# Altium project imu-extend.PrjPcb
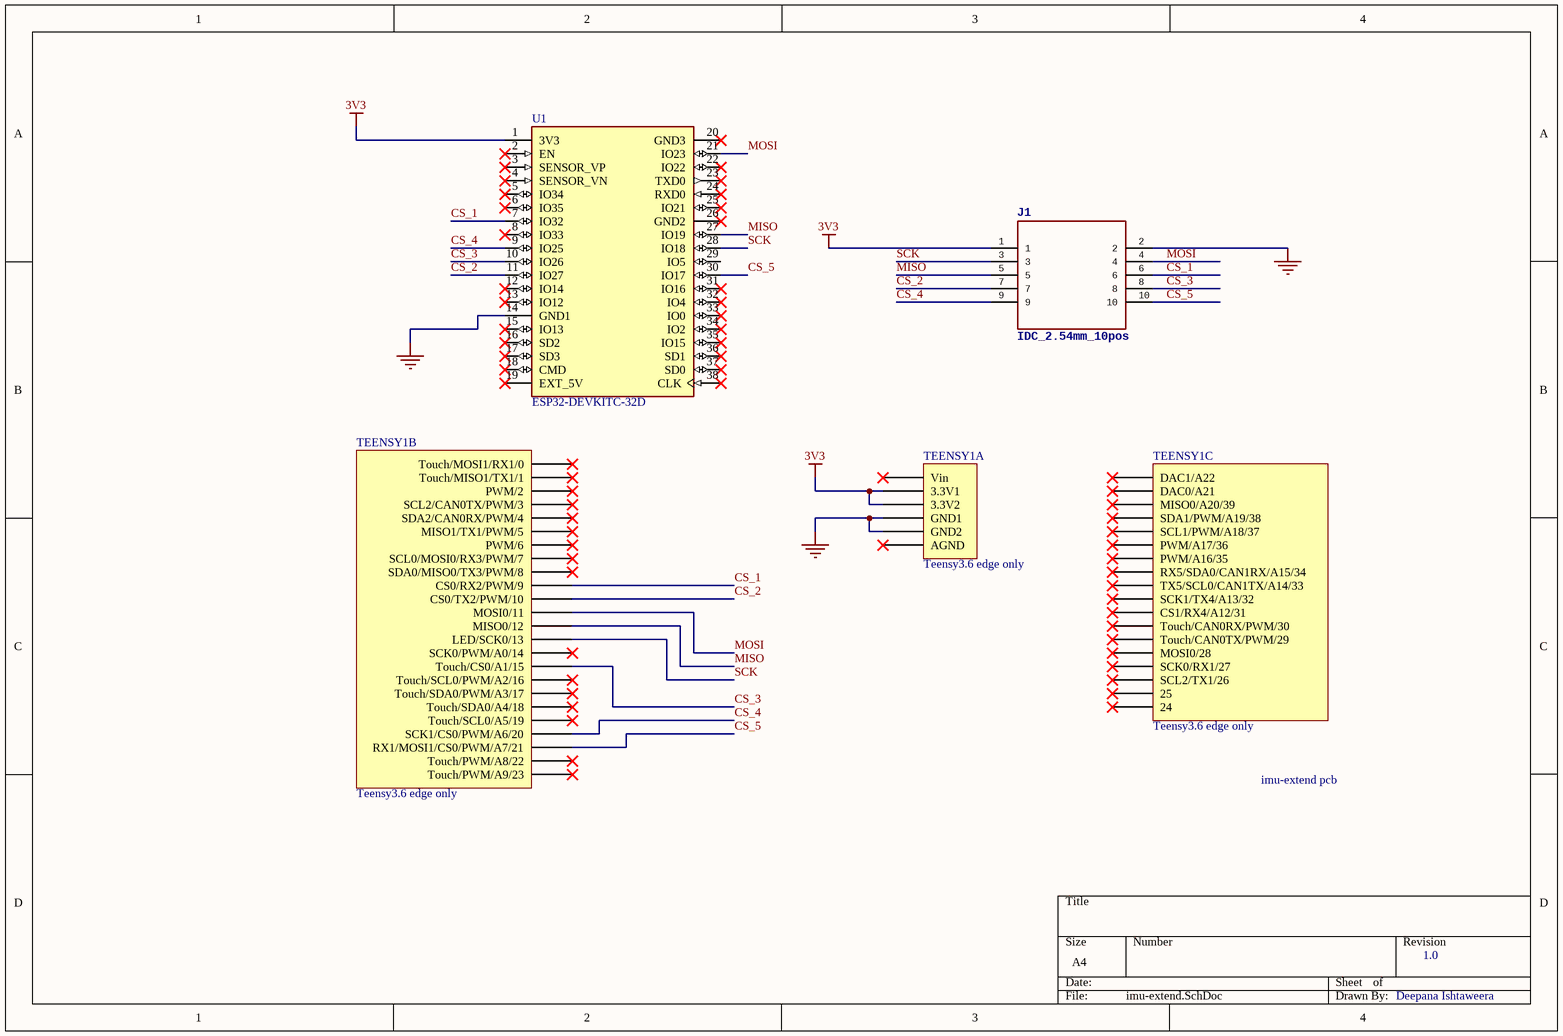
[diagram p0: imu-extend.SchDoc]
1 sheet, 3 parts. Net scope: global (net labels, ports and power ports of the same name join across sheets).
Board file: imu-extend.PcbDoc

## Sheet imu-extend.SchDoc
size A4

### Parts
J1  IDC_2.54mm_10pos  [IDC_2.54_10]
TEENSY1  Teensy3.6 edge only  [Teensy3.6-edgeonly]  (parts A,B,C of 3)
U1  ESP32-DEVKITC-32D  [MODULE_ESP32-DEVKITC-32D]

### Nets
3V3: J1.1 TEENSY1.3.3V1 TEENSY1.3.3V2 U1.1(3V3)
GND: J1.2 TEENSY1.GND1 TEENSY1.GND2 U1.14(GND1)
CS_1: J1.6 TEENSY1.9(CS0/RX2/PWM/9) U1.7(IO32)
CS_2: J1.7 TEENSY1.10(CS0/TX2/PWM/10) U1.11(IO27)
CS_3: J1.8 TEENSY1.15(Touch/CS0/A1/15) U1.10(IO26)
CS_4: J1.9 TEENSY1.20(SCK1/CS0/PWM/A6/20) U1.9(IO25)
CS_5: J1.10 TEENSY1.21(RX1/MOSI1/CS0/PWM/A7/21) U1.30(IO17)
MISO: J1.5 TEENSY1.12(MISO0/12) U1.27(IO19)
MOSI: J1.4 TEENSY1.11(MOSI0/11) U1.21(IO23)
SCK: J1.3 TEENSY1.13(LED/SCK0/13) U1.28(IO18)

Not connected (* = marked no-connect by the designer): TEENSY1 0(Touch/MOSI1/RX1/0)* 1(Touch/MISO1/TX1/1)* 2(PWM/2)* 3(SCL2/CAN0TX/PWM/3)* 4(SDA2/CAN0RX/PWM/4)* 5(MISO1/TX1/PWM/5)* 6(PWM/6)* 7(SCL0/MOSI0/RX3/PWM/7)* 8(SDA0/MISO0/TX3/PWM/8)* 14(SCK0/PWM/A0/14)* 16(Touch/SCL0/PWM/A2/16)* 17(Touch/SDA0/PWM/A3/17)* 18(Touch/SDA0/A4/18)* 19(Touch/SCL0/A5/19)* 22(Touch/PWM/A8/22)* 23(Touch/PWM/A9/23)* 24* 25* 26(SCL2/TX1/26)* 27(SCK0/RX1/27)* 28(MOSI0/28)* 29(Touch/CAN0TX/PWM/29)* 30(Touch/CAN0RX/PWM/30)* 31(CS1/RX4/A12/31)* 32(SCK1/TX4/A13/32)* 33(TX5/SCL0/CAN1TX/A14/33)* 34(RX5/SDA0/CAN1RX/A15/34)* 35(PWM/A16/35)* 36(PWM/A17/36)* 37(SCL1/PWM/A18/37)* 38(SDA1/PWM/A19/38)* 39(MISO0/A20/39)* A21(DAC0/A21)* A22(DAC1/A22)* AGND* VIN(Vin)*; U1 2(EN)* 3(SENSOR_VP)* 4(SENSOR_VN)* 5(IO34)* 6(IO35)* 8(IO33)* 12(IO14)* 13(IO12)* 15(IO13)* 16(SD2)* 17(SD3)* 18(CMD)* 19(EXT_5V)* 20(GND3)* 22(IO22)* 23(TXD0)* 24(RXD0)* 25(IO21)* 26(GND2)* 29(IO5) 31(IO16)* 32(IO4)* 33(IO0)* 34(IO2)* 35(IO15)* 36(SD1)* 37(SD0)* 38(CLK)*

### Notes on the sheet
- imu-extend pcb
- 1.0
- Deepana Ishtaweera

### Library data of the parts
J1 = IDC_2.54mm_10pos: 5x2 male connector (2.54mm)
U1 = ESP32-DEVKITC-32D: - Transceiver; 802.11 b/g/n _Wi-Fi, WiFi, WLAN_, BluetoothÂ® Smart Ready 4.x Dual Mode For Use With ESP-WROOM-32; MF: Espressif Systems; Package: None; Price: None; Availability: Unavailable; MP: ESP32-DEVKITC-32D; SnapEDA_Link: https://www.snapeda.com/parts/ESP32-DEVKITC-32D/Espressif%20Systems/view-part/2777395/?ref=snap; Value: *